# EAGLE design goblin (EAGLE 6.6.0)

## Sheet 1 of 2
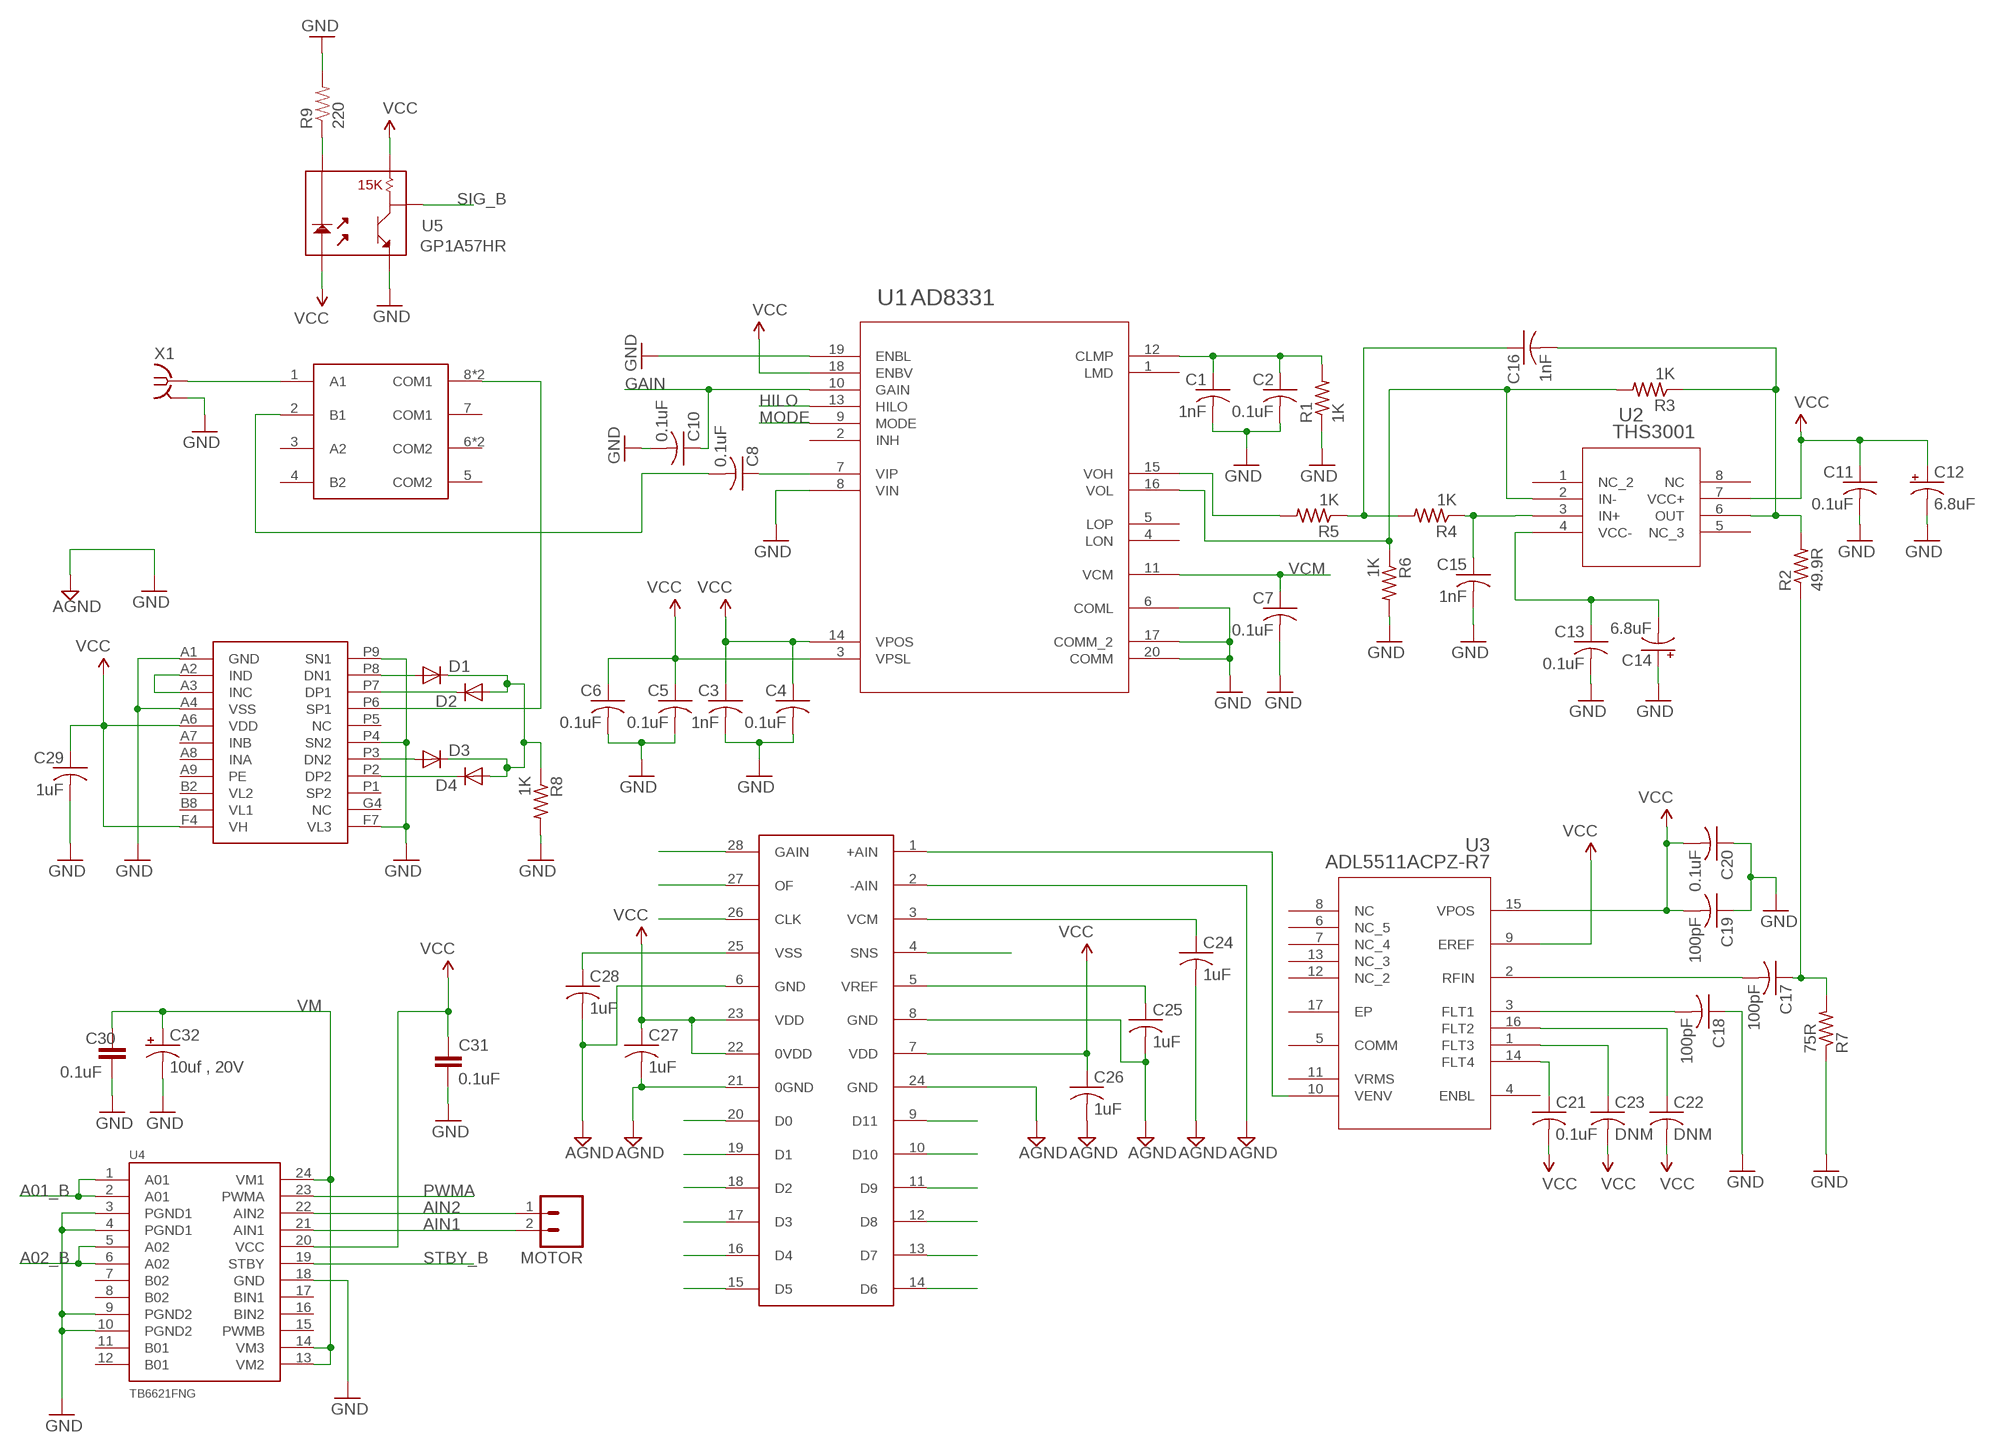
[diagram p0: schematic, sheet 1]

### Parts
C1  1nF  C-USC0402  [C0402]
C2  0.1uF  C-USC0402  [C0402]
C3  1nF  C-USC0402  [C0402]
C4  0.1uF  C-USC0402  [C0402]
C5  0.1uF  C-USC0402  [C0402]
C6  0.1uF  C-USC0402  [C0402]
C7  0.1uF  C-USC0402  [C0402]
C8  0.1uF  C-USC0402  [C0402]
C10  0.1uF  C-USC0402  [C0402]
C11  0.1uF  C-USC0402  [C0402]
C12  6.8uF  CPOL-USA/3216-18W  [A/3216-18W]
C13  0.1uF  C-USC0402  [C0402]
C14  6.8uF  CPOL-USA/3216-18W  [A/3216-18W]
C15  1nF  C-USC0402  [C0402]
C16  1nF  C-USC0402  [C0402]
C17  100pF  C-USC0402  [C0402]
C18  100pF  C-USC0402  [C0402]
C19  100pF  C-USC0402  [C0402]
C20  0.1uF  C-USC0402  [C0402]
C21  0.1uF  C-USC0402  [C0402]
C22  DNM  C-USC0402  [C0402]
C23  DNM  C-USC0402  [C0402]
C24  1uF  C-USC0402  [C0402]
C25  1uF  C-USC0402  [C0402]
C26  1uF  C-USC0402  [C0402]
C27  1uF  C-USC0402  [C0402]
C28  1uF  C-USC0402  [C0402]
C29  1uF  C-USC0402  [C0402]
C30  0.1uF  CAP0402-CAP  [0402-CAP]
C31  0.1uF  CAP0402-CAP  [0402-CAP]
C32  10uf , 20V  CAP_POL3528  [EIA3528]
D1  DIODESOD  [SOD-323]
D2  DIODESOD  [SOD-323]
D3  DIODESOD  [SOD-323]
D4  DIODESOD  [SOD-323]
MOTOR  M02PTH3  [1X02_LONGPADS]
R1  1K  R-US_R0402  [R0402]
R2  49.9R  R-US_R0402  [R0402]
R3  1K  R-US_R0402  [R0402]
R4  1K  R-US_R0402  [R0402]
R5  1K  R-US_R0402  [R0402]
R6  1K  R-US_R0402  [R0402]
R7  75R  R-US_R0402  [R0402]
R8  1K  R-US_R0402  [R0402]
R9  220  RESISTORPTH1  [AXIAL-0.3]
U1  AD8331  AD8331ARQZ-R7  [RQ_20]
U2  THS3001  THS3001_D_8  [D8]
U3  ADL5511ACPZ-R7  [CP_16_22]
U4  TB6621FNG  [SSOP24]
U5  GP1A57HR  [GP1A57HR]
U6  MDO100  [MDO100]
U7  LT3748  LT3768  [LT3768]
U8  LTC1405  [LTC1405]
X1  SMA-142-0701-871/880  [SMA-142-0701-871]

### Nets
A01_B: U4.1(A01) U4.2(A01) ; also sheet 2
A02_B: U4.5(A02) U4.6(A02) ; also sheet 2
AGND: C24.2 C25.2 C26.2 C27.2 C28.2 U8.2(-AIN) U8.6(GND) U8.8(GND) U8.21(0GND) U8.24(GND) ; supply symbol labelled GND ; also sheet 2
AIN1: MOTOR.2 U4.21(AIN1)
AIN2: MOTOR.1 U4.22(AIN2)
CLK: U8.26(CLK) ; also sheet 2
D0: U8.20(D0) ; also sheet 2
D1: U8.19(D1) ; also sheet 2
D2: U8.18(D2) ; also sheet 2
D3: U8.17(D3) ; also sheet 2
D4: U8.16(D4) ; also sheet 2
D5: U8.15(D5) ; also sheet 2
D6: U8.14(D6) ; also sheet 2
D7: U8.13(D7) ; also sheet 2
D8: U8.12(D8) ; also sheet 2
D9: U8.11(D9) ; also sheet 2
D10: U8.10(D10) ; also sheet 2
D11: U8.9(D11) ; also sheet 2
GAIN: C10.1 U1.10(GAIN)
GAIN_ADC_B: U8.28(GAIN) ; also sheet 2
GND: C1.2 C2.2 C3.2 C4.2 C5.2 C6.2 C7.2 C10.2 C11.2 C12.- C13.2 C14.+ C15.2 C18.1 C19.1 C20.1 C29.2 C30.2 C31.2 C32.C(-) R1.1 R6.2 R7.1 R8.2 R9.P$2 U1.6(COML) U1.8(VIN) U1.17(COMM_2) U1.19(ENBL) U1.20(COMM) U4.3(PGND1) U4.4(PGND1) U4.9(PGND2) U4.10(PGND2) U4.18(GND) U5.5 U7.A1(GND) U7.A4(VSS) U7.F7(VL3) U7.P4(SN2) U7.P9(SN1) X1.2@1 X1.2@2 X1.2@3 X1.2@4 ; also sheet 2
HILO: U1.13(HILO)
MODE: U1.9(MODE)
N$1: U6.1(A1) X1.1
N$2: C1.1 C2.1 R1.2 U1.12(CLMP)
N$3: C8.1 U1.7(VIP)
N$4: C13.1 C14.- U2.4(VCC-)
N$6: C8.2 U6.2(B1)
N$7: C16.2 R2.2 R3.1 U2.6(OUT)
N$8: R3.2 R6.1 U1.16(VOL) U2.2(IN-)
N$9: R5.2 U1.15(VOH)
N$10: C17.2 U3.2(RFIN)
N$11: C18.2 U3.3(FLT1)
N$12: C17.1 R2.1 R7.2
N$13: C16.1 R4.2 R5.1
N$14: C15.1 R4.1 U2.3(IN+)
N$15: U6.8(COM1) U6.9(COM1) U7.P6(SP1)
N$16: C21.1 U3.14(FLT4)
N$17: C22.1 U3.16(FLT2)
N$18: C23.1 U3.1(FLT3)
N$19: C24.1 U8.3(VCM)
N$20: C25.1 U8.5(VREF)
N$21: U7.A2(IND) U7.A3(INC)
N$22: D1.2(A) U7.P8(DN1)
N$23: C28.1 U8.25(VSS)
N$25: D2.1(C) U7.P7(DP1)
N$26: U3.10(VENV) U8.1(+AIN)
N$28: D3.2(A) U7.P3(DN2)
N$29: D4.1(C) U7.P2(DP2)
N$30: D1.1(C) D2.2(A) D3.1(C) D4.2(A) R8.1
N$51: R9.P$1 U5.2
OF_B: U8.27(OF) ; also sheet 2
PWMA: U4.23(PWMA) ; also sheet 2
SIG_B: U5.4 ; also sheet 2
SNS_B: U8.4(SNS) ; also sheet 2
STBY_B: U4.19(STBY) ; also sheet 2
VCC: C3.1 C4.1 C5.1 C6.1 C11.1 C12.+ C19.2 C20.2 C21.2 C22.2 C23.2 C26.1 C27.1 C29.1 C31.1 U1.3(VPSL) U1.14(VPOS) U1.18(ENBV) U2.7(VCC+) U3.9(EREF) U3.15(VPOS) U4.20(VCC) U5.1 U5.3 U7.A6(VDD) U7.F4(VH) U8.7(VDD) U8.22(0VDD) U8.23(VDD) ; also sheet 2
VCM: C7.1 U1.11(VCM)
VM: C30.1 C32.A(+) U4.13(VM2) U4.14(VM3) U4.24(VM1)
Unconnected: U1.1(LMD) U1.2(INH) U1.4(LON) U1.5(LOP) U2.1(NC_2) U2.5(NC_3) U2.8(NC) U3.4(ENBL) U3.5(COMM) U3.6(NC_5) U3.7(NC_4) U3.8(NC) U3.11(VRMS) U3.12(NC_2) U3.13(NC_3) U3.17(EP) U4.7(B02) U4.8(B02) U4.11(B01) U4.12(B01) U4.15(PWMB) U4.16(BIN2) U4.17(BIN1) U6.3(A2) U6.4(B2) U6.5(COM2) U6.6(COM2) U6.7(COM1) U6.10(COM2) U7.A7(INB) U7.A8(INA) U7.A9(PE) U7.B2(VL2) U7.B8(VL1) U7.G4(NC) U7.P1(SP2) U7.P5(NC)

### Notes on the sheet
- GAIN
- HILO
- MODE
- VCM

## Sheet 2 of 2
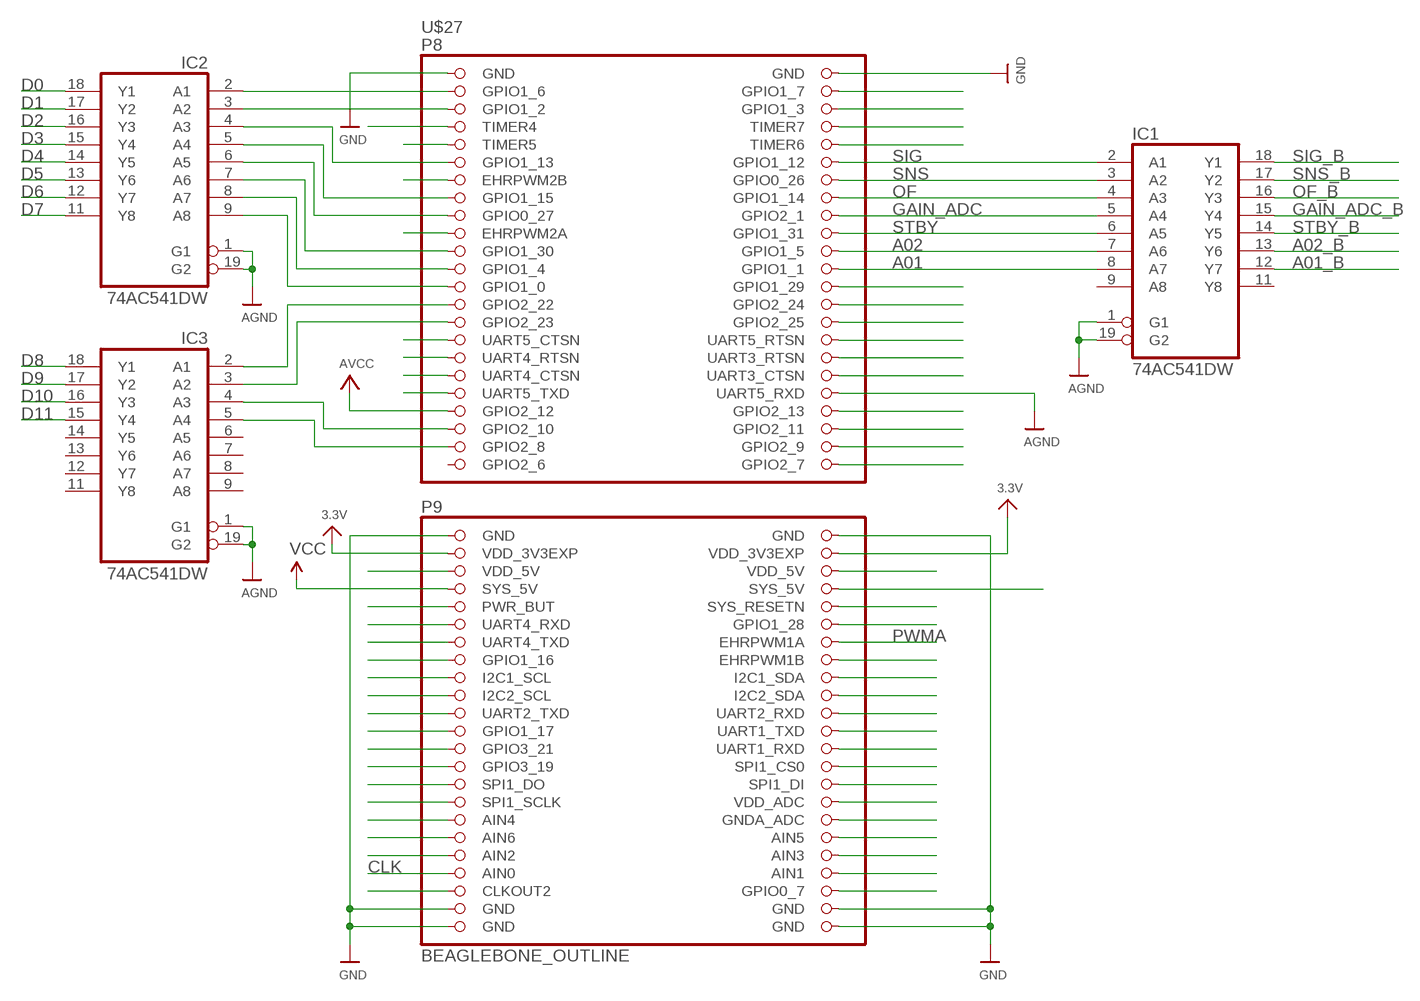
[diagram p1: schematic, sheet 2]

### Parts
IC1  74AC541DW  [SO20W]
IC2  74AC541DW  [SO20W]
IC3  74AC541DW  [SO20W]
U$27  BEAGLEBONE_OUTLINE  [BEAGLEBONE_SHIELD]

### Nets
3.3V: U$27.49(VDD_3V3EXP) U$27.50(VDD_3V3EXP)
5.0V: U$27.54(SYS_5V)
A01_B: IC1.12(Y7) ; also sheet 1
A02: IC1.8(A7) U$27.24(GPIO1_1)
A02_B: IC1.13(Y6) ; also sheet 1
AGND: IC1.1(G1) IC1.19(G2) IC2.1(G1) IC2.19(G2) IC3.1(G1) IC3.19(G2) U$27.38(UART5_RXD) ; also sheet 1
AVCC: U$27.39(GPIO2_12)
CLK: U$27.87(CLKOUT2) ; also sheet 1
D0: IC2.18(Y1) ; also sheet 1
D1: IC2.17(Y2) ; also sheet 1
D2: IC2.16(Y3) ; also sheet 1
D3: IC2.15(Y4) ; also sheet 1
D4: IC2.14(Y5) ; also sheet 1
D5: IC2.13(Y6) ; also sheet 1
D6: IC2.12(Y7) ; also sheet 1
D7: IC2.11(Y8) ; also sheet 1
D8: IC3.18(Y1) ; also sheet 1
D9: IC3.17(Y2) ; also sheet 1
D10: IC3.16(Y3) ; also sheet 1
D11: IC3.15(Y4) ; also sheet 1
GAIN_ADC: IC1.5(A4) U$27.18(GPIO2_1)
GAIN_ADC_B: IC1.15(Y4) ; also sheet 1
GND: U$27.1(GND) U$27.2(GND) U$27.47(GND) U$27.48(GND) U$27.89(GND) U$27.90(GND) U$27.91(GND) U$27.92(GND) ; also sheet 1
N$24: U$27.7(TIMER4)
N$27: U$27.9(TIMER5)
N$31: IC2.5(A4)
N$32: U$27.13(EHRPWM2B)
N$33: IC2.4(A3) U$27.11(GPIO1_13)
N$34: IC2.6(A5) U$27.17(GPIO0_27)
N$35: U$27.19(EHRPWM2A)
N$36: IC2.7(A6) U$27.21(GPIO1_30)
N$37: IC2.8(A7) U$27.23(GPIO1_4)
N$38: IC2.9(A8) U$27.25(GPIO1_0)
N$39: IC3.2(A1) U$27.27(GPIO2_22)
N$40: IC3.3(A2) U$27.29(GPIO2_23)
N$41: U$27.31(UART5_CTSN)
N$42: U$27.33(UART4_RTSN)
N$43: U$27.35(UART4_CTSN)
N$44: U$27.37(UART5_TXD)
N$45: IC3.4(A3) U$27.41(GPIO2_10)
N$46: IC3.5(A4) U$27.43(GPIO2_8)
N$48: U$27.8(TIMER7)
N$49: U$27.10(TIMER6)
N$55: IC1.7(A6) U$27.22(GPIO1_5)
N$57: U$27.26(GPIO1_29)
N$58: U$27.28(GPIO2_24)
N$59: U$27.30(GPIO2_25)
N$60: U$27.32(UART5_RTSN)
N$61: U$27.34(UART3_RTSN)
N$62: U$27.36(UART3_CTSN)
N$63: U$27.40(GPIO2_13)
N$64: U$27.42(GPIO2_11)
N$65: U$27.44(GPIO2_9)
N$66: U$27.46(GPIO2_7)
N$67: U$27.51(VDD_5V)
N$68: U$27.55(PWR_BUT)
N$69: U$27.57(UART4_RXD)
N$70: U$27.59(UART4_TXD)
N$71: U$27.61(GPIO1_16)
N$72: U$27.63(I2C1_SCL)
N$73: U$27.65(I2C2_SCL)
N$74: U$27.67(UART2_TXD)
N$75: U$27.69(GPIO1_17)
N$76: U$27.71(GPIO3_21)
N$77: U$27.73(GPIO3_19)
N$78: U$27.75(SPI1_DO)
N$79: U$27.77(SPI1_SCLK)
N$80: U$27.79(AIN4)
N$81: U$27.81(AIN6)
N$82: U$27.83(AIN2)
N$83: U$27.85(AIN0)
N$85: U$27.52(VDD_5V)
N$86: U$27.56(SYS_RESETN)
N$87: U$27.58(GPIO1_28)
N$89: U$27.62(EHRPWM1B)
N$90: U$27.64(I2C1_SDA)
N$91: U$27.66(I2C2_SDA)
N$92: U$27.68(UART2_RXD)
N$93: U$27.70(UART1_TXD)
N$94: U$27.72(UART1_RXD)
N$95: U$27.74(SPI1_CS0)
N$96: U$27.76(SPI1_DI)
N$97: U$27.78(VDD_ADC)
N$98: U$27.80(GNDA_ADC)
N$99: U$27.82(AIN5)
N$100: U$27.84(AIN3)
N$101: U$27.86(AIN1)
N$102: IC2.2(A1) U$27.3(GPIO1_6)
N$103: IC2.3(A2) U$27.5(GPIO1_2)
N$104: U$27.4(GPIO1_7)
N$105: U$27.6(GPIO1_3)
N$106: U$27.88(GPIO0_7)
OF: IC1.4(A3) U$27.16(GPIO1_14)
OF_B: IC1.16(Y3) ; also sheet 1
PWMA: U$27.60(EHRPWM1A) ; also sheet 1
SIG: IC1.2(A1) U$27.12(GPIO1_12)
SIG_B: IC1.18(Y1) ; also sheet 1
SNS: IC1.3(A2) U$27.14(GPIO0_26)
SNS_B: IC1.17(Y2) ; also sheet 1
STBY: IC1.6(A5) U$27.20(GPIO1_31)
STBY_B: IC1.14(Y5) ; also sheet 1
VCC: U$27.53(SYS_5V) ; also sheet 1
Unconnected: IC1.9(A8) IC1.11(Y8) IC3.6(A5) IC3.7(A6) IC3.8(A7) IC3.9(A8) IC3.11(Y8) IC3.12(Y7) IC3.13(Y6) IC3.14(Y5) U$27.15(GPIO1_15)

### Notes on the sheet
- D0
- D1
- D2
- D3
- D4 | SIG | SIG_B
- D5 | SNS | SNS_B
- D6 | OF | OF_B
- D7 | GAIN_ADC | GAIN_ADC_B
- STBY | STBY_B
- A02 | A02_B
- A01 | A01_B
- D8
- D9
- D10
- D11
- PWMA
- CLK

## Power pins joined to a net without a drawn wire
GND: IC1.10(GND) IC2.10(GND) IC3.10(GND)
GPIO2_6: U$27.45(GPIO2_6)
VCC: IC1.20(VCC) IC2.20(VCC) IC3.20(VCC)

## Library data of the parts
C1-C8 C10 C11 C13 C15-C29 = adafruit:C-US: CAPACITOR, American symbol; OC_FARNELL: unknown
C12 C14 = adafruit:CPOL-US: POLARIZED CAPACITOR, American symbol; OC_FARNELL: unknown
C30 C31 = SparkFun:CAP: Capacitor Standard 0603 ceramic capacitor, and 0.1" leaded capacitor.; OC_FARNELL: unknown
C32 = SparkFun:CAP_POL: Capacitor Polarized These are standard SMD and PTH capacitors. Normally 10uF, 47uF, and 100uF in electrolytic and tantalum varieties. Always verify the external diameter of the through hole cap, it varies with capacity, voltage, and manufacturer. The EIA devices should be standard.; OC_FARNELL: unknown
D1-D4 = SparkFun-DiscreteSemi:DIODE: Diode These are standard reverse protection diodes and small signal diodes. SMA package can handle up to about 1A. SOD-323 can handle about 200mA. What the SOD-323 package when ordering, there are some mfgs out there that are 5-pin packages.; OC_FARNELL: unknown; PROD_ID: DIO-09646
IC1-IC3 = 74xx-eu:74*541: Octal BUFFER and LINE DRIVER, 3-state
MOTOR = SparkFun-Connectors:M02: Standard 2-pin 0.1" header. Use with - straight break away headers ( PRT-00116) - right angle break away headers (PRT-00553) - swiss pins (PRT-00743) - machine pins (PRT-00117) - female headers (PRT-00115) Molex polarized connector foot print use with: PRT-08233 with associated crimp pins and housings. 2.54_SCREWTERM for use with PRT-10571. 3.5mm Screw Terminal footprints for PRT-08084 5mm Screw Terminal footprints for use with PRT-08433; OC_FARNELL: unknown
R1-R8 = adafruit:R-US_: RESISTOR, American symbol; OC_FARNELL: unknown
R9 = SparkFun:RESISTOR: Resistor Basic schematic elements and footprints for 0603, 1206, and PTH 1/10th watt (small) resistors.; OC_FARNELL: unknown
U1 = AD8331ARQZ-R7:AD8331ARQZ-R7; MANUFACTURER_PART_NUMBER: AD8331ARQZ-R7; OC_FARNELL: unknown; VENDOR: Vendor
U2 = THS3001:THS3001_D_8; DATASHEETURL: http://www.ti.com/lit/gpn/THS3001; DESCRIPTION: 420-MHz Current-Feedback Amplifier; FAMILY_NAME: CURRENT FEEDBACK; GENERIC_PART_NUMBER: THS3001; INDUSTRY_STD_PKG_TYPE: SOIC; MANUFACTURER: Texas Instruments; MANUFACTURER_PART_NUMBER: ths3001_d_8; OC_FARNELL: unknown; PACKAGE_DESIGNATOR: D; PIN_COUNT: 8; VENDOR: Texas Instruments
U3 = ADL5511:ADL5511ACPZ-R7; OC_FARNELL: unknown
U4 = SparkFun:TB6621FNG: Toshiba 1A motor driver; OC_FARNELL: unknown
U5 = SparkFun:GP1A57HR; OC_FARNELL: unknown
U6 = MDO100:MDO100; OC_FARNELL: unknown
U7 = HV7360:LT3768; OC_FARNELL: unknown
U8 = LTC1405:LTC1405; OC_FARNELL: unknown
U$27 = microbuilder:BEAGLEBONE_OUTLINE; OC_FARNELL: unknown
X1 = con-coax:SMA-: SMA 50 Ohm End Launch Jack Receptacle - Round Contact Johnson Components Source: www.johnsoncomponents.com .. J502-ND.pdf; OC_FARNELL: unknown; OC_NEWARK: 91B6105

## Board
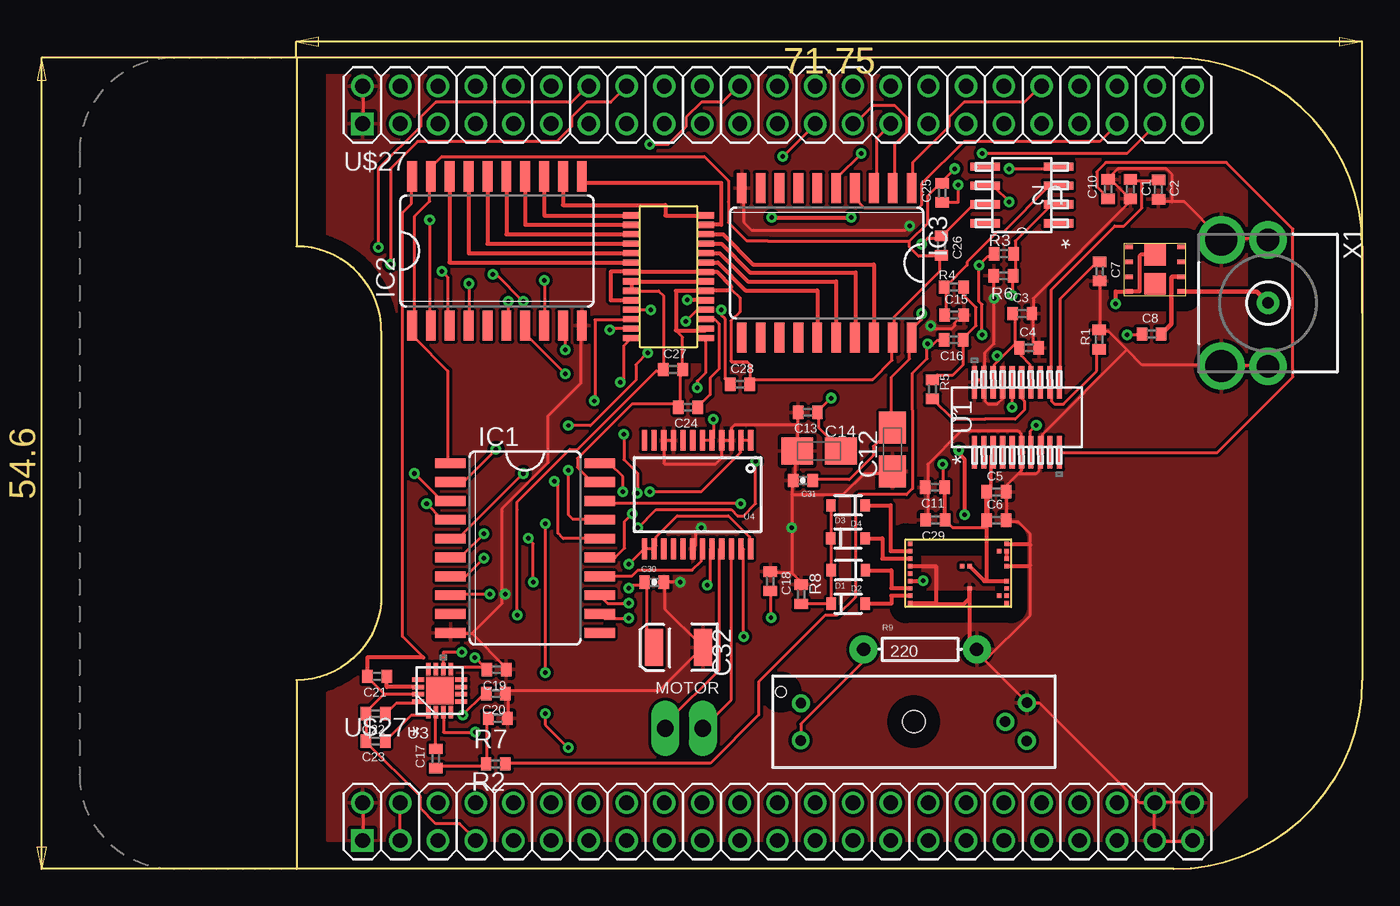
[diagram p2: board, top side]
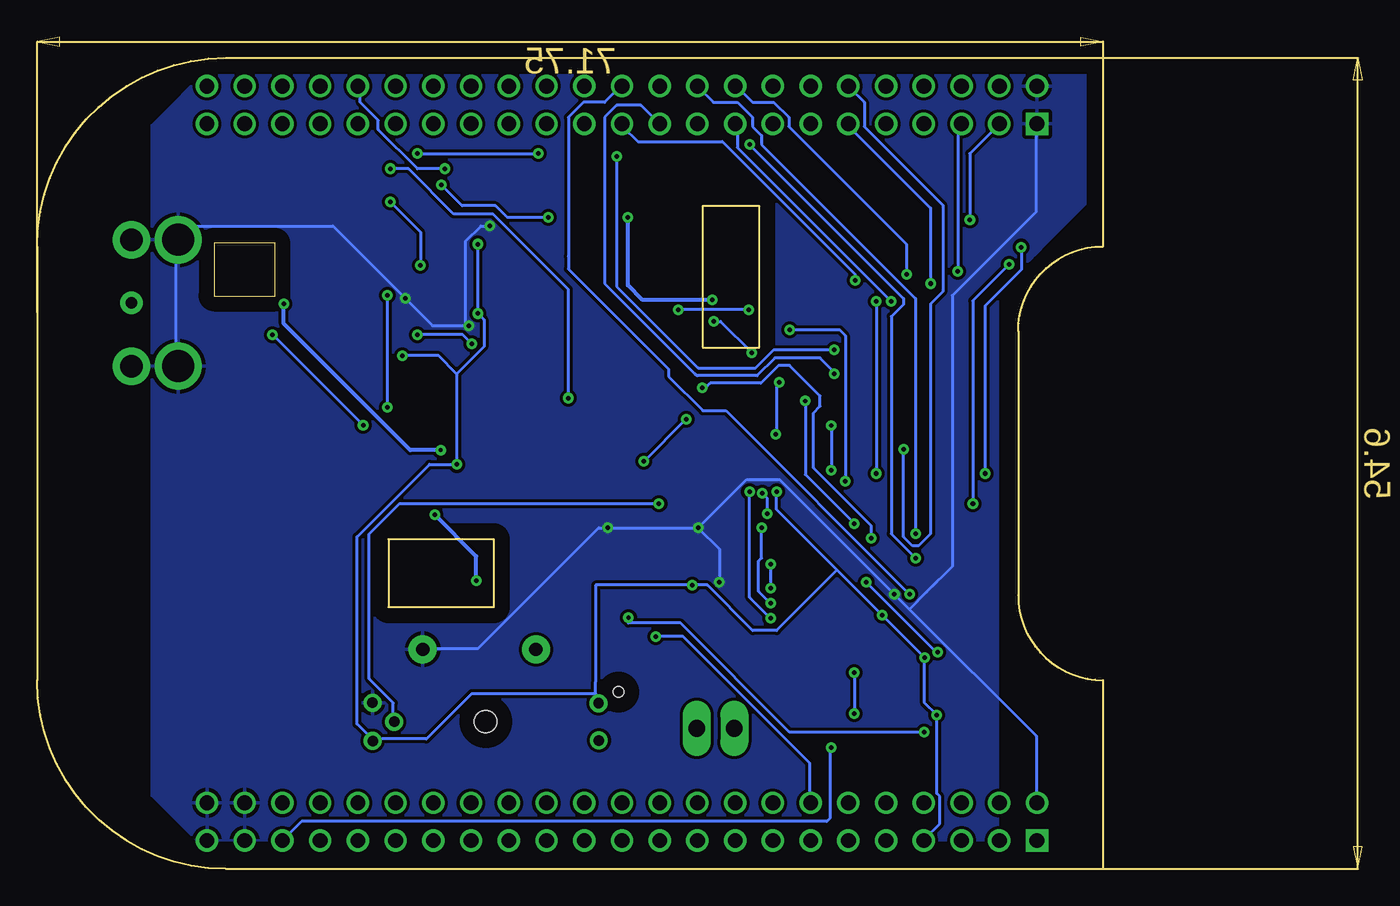
[diagram p3: board, bottom side, seen from below]

Size 71.75 x 54.61 mm. Coordinates in mm from the lower left corner, seen from the top.
Copper layers (1*16): Top 0.035mm / dielectric 1.5mm / Bottom 0.035mm
Design rules "default *": minimum track width 8mil, minimum drill 12mil, track to track 8mil, track to pad 8mil, pad to pad 8mil, via to via 8mil, smd to smd 8mil, copper to edge 40mil, drill to drill 8mil, minimum pad ring 10mil, minimum via ring 8mil, stop-mask expansion 4mil, vias tented up to drill 0mil, thermal gap 10mil

### Footprints (pad centres in the part's own frame; a part is rotated, then mirrored left to right if it is on the bottom)
C0402 = smd 0.7 x 0.9: 1 -0.65,0; 2 0.65,0
A/3216-18W = smd 2.15 x 1.8: + 1.475,0; - -1.475,0
0402-CAP = smd 0.7 x 0.9: 1 -0.65,0; 2 0.65,0
EIA3528 = smd 1.2 x 2.5: A 1.65,0; C -1.65,0
SOD-323 = smd 0.63 x 0.83: 1 -1.15,0; 2 1.15,0
SO20W = smd 0.66 x 2.032: 1 -5.715,-5.029; 2 -4.445,-5.029; 3 -3.175,-5.029; 4 -1.905,-5.029; 5 -0.635,-5.029; 6 0.635,-5.029; 7 1.905,-5.029; 8 3.175,-5.029; 9 4.445,-5.029; 10 5.715,-5.029; 11 5.715,5.029; 12 4.445,5.029; 13 3.175,5.029; 14 1.905,5.029; 15 0.635,5.029; 16 -0.635,5.029; 17 -1.905,5.029; 18 -3.175,5.029; 19 -4.445,5.029; 20 -5.715,5.029
1X02_LONGPADS = drill 1.118 pad 1.88 long: 1 0,0; 2 2.54,0
R0402 = smd 0.7 x 0.9: 1 -0.65,0; 2 0.65,0
AXIAL-0.3 = drill 0.9 pad 1.88: P$1 -3.81,0; P$2 3.81,0
RQ_20 = smd 2.184 x 0.356: 1 -2.362,2.857; 2 -2.362,2.223; 3 -2.362,1.587; 4 -2.362,0.953; 5 -2.362,0.318; 6 -2.362,-0.318; 7 -2.362,-0.953; 8 -2.362,-1.587; 9 -2.362,-2.223; 10 -2.362,-2.857; 11 2.362,-2.857; 12 2.362,-2.223; 13 2.362,-1.587; 14 2.362,-0.953; 15 2.362,-0.318; 16 2.362,0.318; 17 2.362,0.953; 18 2.362,1.587; 19 2.362,2.223; 20 2.362,2.857
D8 = smd 1.981 x 0.559: 1 -2.464,1.905; 2 -2.464,0.635; 3 -2.464,-0.635; 4 -2.464,-1.905; 5 2.464,-1.905; 6 2.464,-0.635; 7 2.464,0.635; 8 2.464,1.905
CP_16_22 = smd 0.813 x 0.305: 1 -1.448,0.75; 2 -1.448,0.25; 3 -1.448,-0.25; 4 -1.448,-0.75; 9 1.448,-0.75; 10 1.448,-0.25; 11 1.448,0.25; 12 1.448,0.75 | smd 0.305 x 0.813: 5 -0.75,-1.448; 6 -0.25,-1.448; 7 0.25,-1.448; 8 0.75,-1.448; 13 0.75,1.448; 14 0.25,1.448; 15 -0.25,1.448; 16 -0.75,1.448 | smd 1.854 x 1.854: 17 0,0
SSOP24 = smd 0.348 x 1.397: 1 -3.575,-3.656; 2 -2.925,-3.656; 3 -2.275,-3.656; 4 -1.625,-3.656; 5 -0.975,-3.656; 6 -0.325,-3.656; 7 0.325,-3.656; 8 0.975,-3.656; 9 1.625,-3.656; 10 2.275,-3.656; 11 2.925,-3.656; 12 3.575,-3.656; 13 3.575,3.656; 14 2.925,3.656; 15 2.275,3.656; 16 1.625,3.656; 17 0.975,3.656; 18 0.325,3.656; 19 -0.325,3.656; 20 -0.975,3.656; 21 -1.625,3.656; 22 -2.275,3.656; 23 -2.925,3.656; 24 -3.575,3.656
GP1A57HR = drill 0.7: 1 -7.6,1.24; 2 -7.62,-1.27; 3 7.6,-1.3; 4 6.15,0; 5 7.62,1.27 | hole 1.5: 0,0 | hole 0.7: -8.95,2
MDO100 = smd 0.3 x 0.5: 1 -1.5,-1.75; 2 -0.5,-1.75; 3 0.5,-1.75; 4 1.5,-1.75; 5 1.5,1.75; 6 0.5,1.75; 7 -0.5,1.75; 8 -1.5,1.75 | smd 1.45 x 1.45: 9 0.975,0; 10 -0.975,0
LT3768 = smd 0.3 x 0.3: A1 -3.25,-2; A2 -3.25,-1.5; A3 -3.25,-1; A4 -3.25,-0.5; A6 -3.25,0.5; A7 -3.25,1; A8 -3.25,1.5; A9 -3.25,2; B2 -2.75,-1.5; B8 -2.75,1.5; F4 -0.75,-0.5; F7 -0.75,1; G4 -0.25,-0.5; P1 3.25,-2; P2 3.25,-1.5; P3 3.25,-1; P4 3.25,-0.5; P5 3.25,0; P6 3.25,0.5; P7 3.25,1; P8 3.25,1.5; P9 3.25,2
LTC1405 = smd 1.143 x 0.419: 1 -2.477,4.128; 2 -2.477,3.493; 3 -2.477,2.857; 4 -2.477,2.223; 5 -2.477,1.587; 6 -2.477,0.953; 7 -2.477,0.318; 8 -2.477,-0.318; 9 -2.477,-0.953; 10 -2.477,-1.587; 11 -2.477,-2.223; 12 -2.477,-2.857; 13 -2.477,-3.493; 14 -2.477,-4.128; 15 2.477,-4.128; 16 2.477,-3.493; 17 2.477,-2.857; 18 2.477,-2.223; 19 2.477,-1.587; 20 2.477,-0.953; 21 2.477,-0.318; 22 2.477,0.318; 23 2.477,0.953; 24 2.477,1.587; 25 2.477,2.223; 26 2.477,2.857; 27 2.477,3.493; 28 2.477,4.128
BEAGLEBONE_SHIELD = drill 1 square: 1 4.445,19.05; 47 52.705,19.05 | drill 1: 2 1.905,19.05; 3 4.445,21.59; 4 1.905,21.59; 5 4.445,24.13; 6 1.905,24.13; 7 4.445,26.67; 8 1.905,26.67; 9 4.445,29.21; 10 1.905,29.21; 11 4.445,31.75; 12 1.905,31.75; 13 4.445,34.29; 14 1.905,34.29; 15 4.445,36.83; 16 1.905,36.83; 17 4.445,39.37; 18 1.905,39.37; 19 4.445,41.91; 20 1.905,41.91; 21 4.445,44.45; 22 1.905,44.45; 23 4.445,46.99; 24 1.905,46.99; 25 4.445,49.53; 26 1.905,49.53; 27 4.445,52.07; 28 1.905,52.07; 29 4.445,54.61; 30 1.905,54.61; 31 4.445,57.15; 32 1.905,57.15; 33 4.445,59.69; 34 1.905,59.69; 35 4.445,62.23; 36 1.905,62.23; 37 4.445,64.77; 38 1.905,64.77; 39 4.445,67.31; 40 1.905,67.31; 41 4.445,69.85; 42 1.905,69.85; 43 4.445,72.39; 44 1.905,72.39; 45 4.445,74.93; 46 1.905,74.93; 48 50.165,19.05; 49 52.705,21.59; 50 50.165,21.59; 51 52.705,24.13; 52 50.165,24.13; 53 52.705,26.67; 54 50.165,26.67; 55 52.705,29.21; 56 50.165,29.21; 57 52.705,31.75; 58 50.165,31.75; 59 52.705,34.29; 60 50.165,34.29; 61 52.705,36.83; 62 50.165,36.83; 63 52.705,39.37; 64 50.165,39.37; 65 52.705,41.91; 66 50.165,41.91; 67 52.705,44.45; 68 50.165,44.45; 69 52.705,46.99; 70 50.165,46.99; 71 52.705,49.53; 72 50.165,49.53; 73 52.705,52.07; 74 50.165,52.07; 75 52.705,54.61; 76 50.165,54.61; 77 52.705,57.15; 78 50.165,57.15; 79 52.705,59.69; 80 50.165,59.69; 81 52.705,62.23; 82 50.165,62.23; 83 52.705,64.77; 84 50.165,64.77; 85 52.705,67.31; 86 50.165,67.31; 87 52.705,69.85; 88 50.165,69.85; 89 52.705,72.39; 90 50.165,72.39; 91 52.705,74.93; 92 50.165,74.93
SMA-142-0701-871 = drill 0.762 pad 1.524: 1 0,0 | drill 1.524 pad 2.54: 2@1 -4.255,0; 2@2 4.255,0 | drill 2.159 pad 2.794: 2@3 -4.255,-3.15; 2@4 4.255,-3.15

### Placement (x,y rotation side)
C1  56.13,45.76 270 top
C2  58.02,45.73 270 top
C3  48.86,37.39 0 top
C4  49.31,35.08 0 top
C5  47.11,25.38 0 top
C6  47.11,23.48 0 top
C7  54.08,40.23 270 top
C8  57.56,36.01 0 top
C10  54.63,45.77 90 top
C11  42.97,25.69 180 top
C12  40.11,28.24 90 top
C13  34.42,30.74 180 top
C14  35.19,28.13 180 top
C15  44.28,37.29 0 top
C16  44.25,35.61 180 top
C17  9.39,7.43 90 top
C18  31.89,19.36 270 top
C19  13.47,13.42 180 top
C20  13.43,11.79 180 top
C21  5.43,12.96 180 top
C22  5.32,10.46 180 top
C23  5.32,8.61 180 top
C24  26.36,31.08 180 top
C25  43.47,45.51 90 top
C26  43.42,41.97 270 top
C27  25.35,33.62 0 top
C28  29.86,32.62 0 top
C29  43.02,23.49 180 top
C30  24.08,19.29 0 top
C31  34.09,26.15 180 top
C32  25.72,14.9 180 top
D1  37.14,17.85 0 top
D2  37.16,20.1 180 top
D3  37.12,22.25 0 top
D4  37.14,24.47 180 top
IC1  15.39,21.6 270 top
IC2  13.5,41.6 0 top
IC3  35.69,40.8 180 top
MOTOR  27.36,9.46 180 top
R1  54.05,35.64 270 top
R2  13.41,7.07 0 top
R3  47.62,41.42 0 top
R4  44.27,39.17 0 top
R5  42.81,32.29 270 top
R6  47.59,39.93 180 top
R7  13.55,10.13 180 top
R8  33.97,18.49 90 top
R9  41.98,14.78 0 top
U1  48.5,30.4 90 top
U2  48.83,45.37 180 top
U3  9.64,12 90 top
U4  27,25.2 180 top
U5  41.56,9.91 0 top
U6  57.8,40.37 90 top
U7  44.55,19.88 180 top
U8  25.04,39.87 180 top
U$27  -14.61,54.61 270 top
X1  65.41,38.1 270 top

### Tracks (layer width: path | path; a pad name or v marks a point on that pad's centre or on a via)
3.3V
  Top 0.203: U$27.49 6.93,2.03 6.93,4.27 U$27.50
A01_B  (via drill 0.3)
  Top 0.203: U4.1 30.5,28.85 30.1,28.85 U4.2 29.9,28.85 29.9,28.04 27.25,25.4 v23.8,25.4 | v22.38,16.87 20.75,16.87 20.55,17.07 IC1.12
  Bottom 0.203: v23.8,25.4 23.8,18.29 v22.38,16.87
A02  (via drill 0.3)
  Top 0.203: v13.03,18.49 10.39,18.49 IC1.8
  Bottom 0.2: 35.99,41.25 35.99,40.4 29.25,33.65 29.25,33.15 26.94,30.85 25.39,30.85 v13.03,18.49
  Bottom 0.203: 35.99,41.25 35.99,50.6 34.98,51.61 33.55,51.61 32.54,52.63 U$27.24
A02_B  (via drill 0.3)
  Top 0.203: U4.6 27.46,28.85 27.86,28.85 U4.5 28.07,29.06 v28.07,30.28 | v30.91,27.43 30.91,24.59 30.1,23.77 29.69,23.77 29.29,24.18 24.21,24.18 v22.99,22.96 | v22.38,17.88 20.96,17.88 20.55,18.29 IC1.13
  Bottom 0.203: v30.91,27.43 v28.07,30.28 | v22.99,22.96 22.99,20.93 23.19,20.73 23.19,18.69 v22.38,17.88
AGND  (via drill 0.3)
  Top 0.2: 29.08,44.91 29.08,43.51 30.33,42.27 31.72,42.27 | 29.29,34.14 30.36,34.14 | 30.36,34.14 30.54,33.95 30.54,32.95 | 30.54,32.95 30.54,32.65 C28.2 | C27.2 26,35.8 25.54,36.25 | 28.29,40.2 28.29,40.15 29.25,39.2 | 30.36,34.14 30.35,34.15 29.29,34.15 29.25,34.2 29.25,36.9 29.85,37.5 29.85,38.45 29.29,39.01 | 30.54,32.95 38.8,32.95 40.09,34.25 40.09,35.73 IC3.19
  Top 0.203: IC1.1 10.18,27.43 10.18,33.53 7.95,35.76 7.95,36.37 IC2.1 7.95,36.58 7.95,43.94 8.97,44.95 8.97,46.53 IC2.19 9.17,46.74 9.17,47.35 9.78,47.95 27.46,47.95 29.08,46.33 29.08,44.91 | IC3.1 41.48,45.92 41.48,47.55 43.92,49.99 43.92,50.6 44.93,51.61 49,51.61 50.01,52.63 U$27.38 | 43.31,41.25 43.31,40.23 40.26,37.19 40.26,35.97 IC3.19 | 41.28,42.27 42.49,43.48 42.49,45.31 43.31,46.13 C25.2 43.51,46.33 v44.32,47.14 | 41.28,42.27 41.28,41.86 41.89,41.25 43.31,41.25 | 43.31,41.25 C26.2 | C27.2 25.83,33.53 25.83,31.5 C24.2 25.63,31.29 22.58,31.29 18.92,27.64 18.92,27.03 19.74,26.21 20.35,26.21 IC1.19 | 29.29,39.01 29.25,39.1 | 31.72,42.27 41.28,42.27
  Top 0.254: U8.24 21.14,38.28 21.14,40.2 U8.21 U8.8 28.29,40.2 29.25,39.25 29.25,39.2 29.25,39.1 29.1,38.95 27.55,38.95 U8.6 25.54,38.92 25.54,36.25 27.52,36.25 U8.2
  Bottom 0.203: v44.32,47.14 46.15,47.14 48.79,49.78 48.79,50.39 50.01,51.61 50.01,52.63 U$27.38
AIN1
  Top 0.203: U4.21 28.47,21.54 28.47,13.41 25.02,9.96 25.02,9.55 MOTOR.2
AIN2
  Top 0.203: U4.22 29.29,11.38 27.46,9.55 MOTOR.1
CLK  (via drill 0.3)
  Top 0.2: U8.26 22.57,36.95 20.1,36.95 20.1,31.55 v20.04,31.5 | v16.75,23.25 v16.75,13.2 | v16.75,10.45 16.75,9.7 v18.29,8.15
  Bottom 0.2: v20.04,31.5 20.04,26.55 v16.75,23.25 | v16.75,13.2 v16.75,10.45 | v18.29,8.15 18.39,8.05 18.39,3.4 18.6,3.2 53.95,3.2 U$27.87
D0
  Top 0.254: IC2.18 10.29,46.63 10.29,40.82 U8.20
D1
  Top 0.254: IC2.17 11.59,41.46 U8.19
D2
  Top 0.254: IC2.16 12.86,42.09 U8.18
D3
  Top 0.254: IC2.15 14.13,42.73 U8.17
D4
  Top 0.254: IC2.14 15.4,43.36 U8.16
D5
  Top 0.254: IC2.13 16.67,44 U8.15
D6
  Top 0.254: IC2.12 17.94,44.7 24.85,44.7 24.85,44 U8.14
D7
  Top 0.254: IC2.11 19.21,46.2 28.6,46.2 28.6,43.36 U8.13
D8
  Top 0.254: U8.12 28.72,42.73 30.75,40.7 38.87,40.7 IC3.18
D9
  Top 0.254: U8.11 28.6,42.09 30.54,40.15 37.64,40.15 37.64,35.82 IC3.17
D10
  Top 0.254: U8.10 28.49,41.46 30.39,39.55 36.33,39.55 IC3.16
D11
  Top 0.254: U8.9 28.37,40.82 30.25,38.95 35.06,38.95 IC3.15
GAIN
  Top 0.203: C10.1 54.48,45.31 53.87,45.92 53.87,46.94 54.48,47.55 62.61,47.55 67.08,43.08 67.08,33.12 62,28.04 51.44,28.04 U1.10
GAIN_ADC  (via drill 0.3)
  Top 0.203: v15.27,26.62 11,22.35 10.39,22.35 IC1.5 | v15.27,38.2 13.44,40.03 v13.23,40.03
  Bottom 0.203: v15.27,38.2 v15.27,26.62 | v13.23,40.03 13.23,42.06 21.16,49.99 21.16,50.6 22.17,51.61 23.6,51.61 24.61,52.63 U$27.18
GAIN_ADC_B  (via drill 0.3)
  Top 0.2: IC1.15 21.46,20.96 22.1,21.6 22.1,23.4 v22.6,23.9 | v21.79,32.75 22.04,33 22.04,35.22 U8.28 | v22.04,29.25 22.04,27.55 22.94,26.65 v22.94,25.3
  Bottom 0.2: v22.6,23.9 22.6,24.95 v22.94,25.3 | v21.79,32.75 22,32.75 22,29.3 v22.04,29.25
GND  (via drill 0.3)
  Top 0.2: 30.1,45.11 30.1,43.55 30.64,43 40.99,43 v41.28,43.28 | U4.10 24.73,27.32 24.79,27.25 28.19,27.25 28.64,27.7 28.64,28.84 U4.4 | 13.84,24.07 13.84,24.25 16.95,27.35 16.95,30.5 19.14,32.7 19.14,35.85 19.25,35.95 19.25,36.54 IC2.10
  Top 0.203: C29.2 42.49,23.57 42.49,25.6 C11.2 42.49,25.81 42.49,27.23 44.73,29.46 48.59,29.46 48.79,29.26 48.79,28.04 U1.6 48.79,27.84 48.79,26.82 48.59,26.62 | 48.59,26.62 47.78,25.81 47.78,25.4 C5.2 47.78,25.2 47.78,23.57 C6.2 47.78,23.37 48.59,23.37 49.4,22.55 49.4,21.8 49.4,20.45 49.4,17.07 46.36,14.02 | 48.59,26.62 49.81,26.62 50.01,26.82 50.01,27.84 U1.8 50.22,28.04 50.22,29.26 55.91,34.95 | C7.2 54.08,39.42 54.08,36.37 R1.1 54.08,36.17 54.69,36.17 55.91,34.95 | 55.91,34.95 56.92,33.93 62.2,33.93 X1.2@4 62.41,33.93 65.25,33.93 X1.2@2 | C4.2 49.81,35.15 49.61,35.36 49.61,37.39 C3.2 49.61,37.59 49.61,38.41 56.11,44.91 C1.2 56.11,45.11 54.69,46.53 | R6.2 46.97,39.83 v46.97,38.41 46.97,35.36 46.36,34.75 46.36,32.92 U1.19 | U1.20 45.75,32.92 46.15,32.92 U1.19 | U1.17 47.57,32.72 47.57,31.7 47.17,31.29 46.56,31.29 46.36,31.5 46.36,32.72 U1.19 | v42.7,36.58 42.9,36.37 44.12,36.37 44.32,36.58 44.32,36.78 44.73,37.19 C15.2 | 58.95,44.91 59.77,44.91 62.2,42.47 X1.2@3 62.41,42.47 65.25,42.47 X1.2@1 | 58.95,44.91 58.14,44.91 C2.2 | 30.1,45.11 30.1,45.72 IC3.10 | 54.69,46.53 55.3,47.14 58.55,47.14 58.95,46.74 58.95,44.91 | 54.69,46.53 C10.2 | 11.81,15.85 14.05,13.61 C19.1 | 11.81,15.85 10.39,15.85 IC1.10 | 13.84,18.49 13.84,17.88 11.81,15.85 | 13.84,18.49 13.84,24.07 | 19.13,36.37 IC2.10 | U4.10 24.82,28.85 25.22,28.85 U4.9 | U4.4 28.68,28.85 U4.3 29.29,29.06 29.29,29.67 29.49,29.87 33.76,29.87 | 33.35,19.91 31.93,19.91 C18.1 | 33.35,19.91 33.96,19.3 R8.2 | 33.76,29.87 33.76,28.25 C14.+ 33.55,28.04 33.55,26.21 C31.2 33.35,26.01 33.35,25.2 | 33.76,29.87 33.76,30.68 C13.2
  Top 0.203: 33.35,25.2 v33.35,22.96 33.35,19.91 | 33.35,25.2 36.8,25.2 38.23,26.62 40.06,26.62 C12.- | R7.1 14.25,10.16 14.25,11.79 C20.1 14.25,11.99 24.41,11.99 27.25,14.83 C32.C 27.25,15.04 24.82,17.48 24.82,19.1 C30.2 24.82,19.3 v25.83,19.3 | U$27.91 60.17,1.83 57.94,1.83 U$27.89 57.73,2.03 57.73,4.27 U$27.90 | U$27.90 57.94,4.47 60.17,4.47 U$27.92 | U$27.47 4.5,2.03 4.5,4.27 U$27.48 | v27.25,22.96 26.85,22.55 26.85,21.74 U4.18 | 46.36,14.02 45.75,14.63 R9.P$2 46.36,14.02 | 46.36,14.02 49,11.38 U5.5 49.2,11.18 50.01,11.18 56.72,4.47 57.73,4.47 U$27.90 | v14.05,18.49 13.84,18.49 | U$27.1 4.5,50.19 4.5,52.63 U$27.2
  Top 0.254: U7.P4 43.05,20.38 43.05,17.9 43.03,17.88 U7.P9 41.33,17.85 44.94,17.85 45.3,18.21 U7.F7 45.3,14.78 R9.P$2 | U7.A1 49.32,21.88 49.4,21.8 | U7.A4 49.33,20.38 49.4,20.45
  Bottom 0.2: 4.5,44.24 4.65,44.09 10.14,38.6 10.14,20.36 11.88,18.63
  Bottom 0.203: 42.9,36.58 45.14,36.58 v46.97,38.41 51.84,43.28 61.39,43.28 62.2,42.47 X1.2@3 62.41,42.27 62.41,33.93 X1.2@4 | v41.28,43.28 41.89,43.28 42.9,42.27 42.9,36.58 | 42.9,36.58 v42.7,36.58 | v27.25,22.96 v33.35,22.96 33.96,22.96 42.09,14.83 45.75,14.83 R9.P$2 | 13.03,17.48 v14.05,18.49 21.77,26.21 24,26.21 v27.25,22.96 | 13.03,17.48 4.5,8.94 4.5,4.47 U$27.48 | v25.83,19.3 25.83,21.54 v27.25,22.96 | 4.5,44.24 4.5,49.99 U$27.1 | 13.03,17.48 11.88,18.63 11.2,19.3
  pour Top: 2.09,54.05 59.94,54.05 63.94,50.05 63.94,4.85 60.99,1.9 2.09,1.9
  pour Bottom: 1.39,54.1 59.99,54.1 64.05,50.05 64.05,4.95 61.05,1.95 7.14,1.95 7.09,1.9 7.09,38.85 1.2,44.75 1.2,54.1
N$1
  Top 0.305: U6.1 64.63,38.87 X1.1
N$2
  Top 0.203: 56.92,46.33 56.31,46.33 C1.1 | 56.92,46.33 57.94,46.33 C2.1 | R1.2 53.87,34.95 53.87,33.53 51.64,31.29 51.03,31.29 50.83,31.5 50.83,32.72 U1.12 50.83,32.92 50.83,39.01 55.09,43.28 55.7,43.28 56.92,44.5 56.92,46.33
N$3  (via drill 0.3)
  Top 0.203: v55.91,35.97 56.72,35.97 C8.1 | v49.81,29.87 49.4,29.46 49.4,28.04 U1.7
  Bottom 0.203: v49.81,29.87 v55.91,35.97
N$4  (via drill 0.3)
  Top 0.203: C14.- 36.6,28.25 35.18,29.67 35.18,30.68 C13.1 35.18,30.89 v35.99,31.7 | v47.98,47.14 51.23,47.14 U2.4
  Bottom 0.203: v47.98,47.14 46.76,47.14 43.71,44.09 41.07,44.09 35.99,39.01 v35.99,31.7
N$6
  Top 0.305: U6.2 58.96,39.87 58.89,39.8 58.89,36.69 C8.2
N$7  (via drill 0.3)
  Top 0.2: 41.48,30.89 41.48,33.38 42.44,34.35 42.44,35.31 v42.49,35.36
  Top 0.203: v47.98,44.91 46.97,45.92 46.56,45.92 U2.6 | R3.1 46.97,41.25 46.56,41.25 v45.95,40.64 45.95,38.2 46.15,38 v46.15,35.97 | 41.48,30.89 41.48,25.6 41.07,25.2 37.82,25.2 37.62,24.99 37.62,18.29 36.4,17.07 35.58,17.07 31.11,12.6 31.11,10.36 27.86,7.11 14.25,7.11 R2.2 | C16.2 43.51,35.56 43.1,35.56 42.7,35.15 v42.49,35.36
  Bottom 0.203: v45.95,40.64 45.95,42.88 v47.98,44.91 | v46.15,35.97 43.1,35.97 v42.49,35.36
N$8  (via drill 0.3)
  Top 0.203: U2.2 51.23,44.7 50.83,44.7 48.39,42.27 48.39,41.45 R3.2 48.39,41.25 48.39,40.03 R6.1 48.18,39.83 v48.18,38.61 | v48.18,31.09 48.18,32.72 U1.16
  Bottom 0.203: v48.18,38.61 v48.18,31.09
N$9
  Top 0.2: R5.2 44.18,30.28 46.36,30.28
  Top 0.203: 46.36,30.28 48.39,30.28 49,30.89 49,31.5 48.79,31.7 48.79,32.72 U1.15
N$10
  Top 0.203: U3.2 9.37,10.36 9.37,8.13 C17.2
N$11  (via drill 0.3)
  Top 0.2: U3.3 9.89,9.2 v12.04,9.2 | v31.94,16.9 31.94,18.71 C18.2
  Bottom 0.2: v12.04,9.2 21.1,9.2 28.44,16.55 31.94,16.55 v31.94,16.9
N$12
  Top 0.203: C17.1 9.58,6.91 12.62,6.91 R2.1 12.83,7.11 12.83,9.96 R7.2
N$13
  Top 0.2: R5.1 43.12,33.25 44.19,33.25 44.89,33.95 C16.1
  Top 0.203: R4.2 44.93,39.01 44.93,38.61 45.75,37.8 45.75,36.58 44.93,35.76 C16.1
N$14
  Top 0.203: C15.1 43.71,37.39 43.71,39.01 R4.1 43.71,39.22 45.14,40.64 45.14,40.84 47.17,42.88 47.57,42.88 50.62,45.92 51.23,45.92 U2.3
N$15  (via drill 0.3)
  Top 0.254: U6.9 56.84,41.34 56.74,41.25 56.74,38.87 U6.8 55.14,38.87 v55.14,38.05 | U7.P6 42.19,19.38 v42.19,19.4 | v45,23.85 45,27.55 44.59,27.95 v44.59,28.2
  Bottom 0.254: v42.19,19.4 42.19,21.05 v45,23.85 | v44.59,28.2 46.64,28.2 55.14,36.7 v55.14,38.05
N$16
  Top 0.254: U3.14 | U3.14 6.07,12.25 C21.1
N$17
  Top 0.203: U3.16 8.15,11.18 6.73,11.18 6.12,10.57 C22.1
N$18
  Top 0.203: U3.1 8.76,10.36 7.75,10.36 6.12,8.74 C23.1
N$19
  Top 0.2: U8.3 28.13,37.01 28.43,36.71 28.43,33.64 27.85,33.05 27.85,31.92 C24.1
N$20  (via drill 0.3)
  Top 0.2: v44.55,46.05 44.55,44.86 C25.1
  Top 0.254: U8.5 26.29,38.28 v26.29,38.3 | v32,43.85 v37.34,43.85
  Bottom 0.2: v37.34,43.85 40.09,43.85 40.89,44.65 43.14,44.65 v44.55,46.05
  Bottom 0.254: v26.29,38.3 31,38.3 32,39.3 v32,43.85
N$21
  Top 0.254: U7.A2 U7.A3
N$22
  Top 0.254: U7.P8 40.05,18.38 40.05,17.85 D1.2
N$23  (via drill 0.3)
  Top 0.2: U8.25 v23.84,37.65 v23.85,37.65 | v28.6,37.65 28.6,37.3 28.85,37.05 28.85,32.99 C28.1
  Bottom 0.2: v23.84,37.65 v28.59,37.65 v28.6,37.65
N$25
  Top 0.254: D2.1 40.05,20.1 40.05,18.9 41.3,18.9 U7.P7
N$26  (via drill 0.3)
  Top 0.2: U3.10 9.89,14.6 | 9.89,14.6 | 9.89,14.6 v11.14,14.6 | v15.95,19.3 15.95,21.9 v15.59,22.25 | U8.1 27.52,33.38 27,32.85 v27,32.4
  Bottom 0.2: v11.14,14.6 11.25,14.6 v15.95,19.3 | v15.59,22.25 15.59,23.1 19.5,27 19.5,30.7 19.04,31.15 19.04,31.85 21.1,33.9 21.85,33.9 23.04,32.7 26.44,32.7 26.75,32.4 v27,32.4
N$28
  Top 0.254: D3.2 39.44,22.25 39.44,20.9 41.3,20.9 U7.P3
N$29
  Top 0.254: D4.1 40,24.47 40,21.4 41.3,21.4 U7.P2
N$30
  Top 0.203: 35.99,17.88 34.16,17.88 R8.1 | D4.2 35.99,24.38 35.99,22.35 D3.1 35.99,22.15 35.99,20.12 D2.2 35.99,19.91 35.99,17.88 | 35.99,17.88 D1.1
N$33  (via drill 0.3)
  Top 0.203: v11.61,39.41 11.61,36.58 IC2.4
  Bottom 0.203: v11.61,39.41 11.61,44.5 17.09,49.99 U$27.11
N$34  (via drill 0.3)
  Top 0.203: v14.25,38.2 14.25,36.58 IC2.6
  Bottom 0.203: v14.25,38.2 24.61,48.56 24.61,49.99 U$27.17
N$36  (via drill 0.3)
  Top 0.203: v18.11,33.33 15.47,35.97 15.47,36.37 IC2.7
  Bottom 0.2: v18.11,33.33 18.11,33.47 19.04,34.4 22.1,34.4 23.29,33.2 27.33,33.2 27.46,33.33
  Bottom 0.203: 27.46,33.33 33.55,39.42 33.55,50.6 32.74,51.41 31.11,51.41 29.9,50.19 U$27.21
N$37  (via drill 0.3)
  Top 0.203: v16.69,39.62 16.69,36.58 IC2.8
  Bottom 0.203: v16.69,39.62 16.69,40.03 25.63,48.97 31.32,48.97 32.33,49.99 U$27.23
N$38  (via drill 0.3)
  Top 0.203: v18.11,34.95 18.11,36.37 IC2.9 | v32.74,47.95 34.77,49.99 U$27.25
  Bottom 0.203: v18.11,34.95 22.17,34.95 23.38,33.73 27.25,33.73 32.74,39.22 v32.74,47.95
N$39
  Top 0.203: IC3.2 40.26,45.92 40.26,48.77 41.07,49.58 41.07,50.6 40.26,51.41 38.84,51.41 37.62,50.19 U$27.27
N$40
  Top 0.203: IC3.3 39.04,45.92 39.04,49.17 39.85,49.99 U$27.29
N$45
  Top 0.203: IC3.4 37.62,45.72 37.62,45.11 38.23,44.5 41.89,44.5 42.09,44.7 42.09,46.13 44.93,48.97 54.08,48.97 55.09,49.99 U$27.41
N$46  (via drill 0.3)
  Top 0.203: v38.02,48.16 36.4,46.53 36.4,45.92 IC3.5 | v46.15,48.16 55.91,48.16 57.73,49.99 U$27.43
  Bottom 0.203: v46.15,48.16 v38.02,48.16
N$51
  Top 0.203: U5.2 33.96,8.74 33.96,9.75 38.02,13.82 38.02,14.63 R9.P$1
N$55  (via drill 0.3)
  Top 0.203: v12.62,20.93 11.41,19.71 10.39,19.71 IC1.7 | v23.8,48.77 25.02,48.77 26.24,49.99 26.24,50.6 27.25,51.61 28.68,51.61 29.69,52.63 U$27.22
  Bottom 0.203: v12.62,20.93 14.25,22.55 14.25,37.19 13.44,38 13.44,38.41 v23.8,48.77
N$102  (via drill 0.3)
  Top 0.203: v8.97,43.69 8.97,36.58 IC2.2
  Bottom 0.203: v8.97,43.69 8.97,48.16 7.14,49.99 U$27.3
N$103  (via drill 0.3)
  Top 0.203: v9.78,40.23 10.18,39.83 10.18,36.58 IC2.3
  Bottom 0.203: v9.78,40.23 9.78,49.78 9.58,49.99 U$27.5
OF  (via drill 0.3)
  Top 0.203: v8.76,24.59 9.78,23.57 10.18,23.57 IC1.4 | v6.32,40.7 6.32,47.14 8.15,48.97 17.5,48.97 18.52,49.99 18.52,50.6 19.53,51.61 21.16,51.61 22.17,52.63 U$27.16
  Bottom 0.203: v8.76,24.59 8.76,38.26 v6.32,40.7
OF_B  (via drill 0.3)
  Top 0.2: U8.27 21.17,36.38 v21.1,36.3 | IC1.16 17.96,22.23 17.6,22.6 17.6,25.85 v17.34,26.1
  Bottom 0.2: v21.1,36.3 17.75,36.3 17.34,35.9 v17.34,26.1
PWMA  (via drill 0.3)
  Top 0.203: v30.1,15.65 30.1,21.54 U4.23
  Bottom 0.203: v30.1,15.65 28.27,15.65 19.74,7.11 19.74,4.47 U$27.60
SIG  (via drill 0.3)
  Top 0.203: v13.44,28.25 11.41,26.21 10.39,26.21 IC1.2
  Bottom 0.203: v13.44,28.25 13.44,22.35 12.83,21.74 12.42,21.74 11.61,22.55 11.61,38.04 10.79,38.85 10.79,44.7 16.08,49.99 16.08,51.61 17.09,52.63 U$27.12
SIG_B  (via drill 0.3)
  Top 0.203: v29.9,24.59 20.55,24.59 IC1.18
  Bottom 0.203: v29.9,24.59 47.37,24.59 49.4,22.55 49.4,12.8 47.78,11.18 47.78,9.96 U5.4
SNS  (via drill 0.3)
  Top 0.203: v7.95,26.62 9.78,24.79 10.18,24.79 IC1.3 | v5.51,41.86 5.51,47.14 8.36,49.99 8.36,50.6 9.37,51.61 18.52,51.61 19.53,52.63 U$27.14
  Bottom 0.203: v7.95,26.62 7.95,37.91 5.51,40.34 v5.51,41.86
SNS_B  (via drill 0.3)
  Top 0.2: v23.64,34.75 22.85,33.95 22.85,32.9 19.79,29.85 v18.29,29.85 | v18.29,26.85 18.29,23.85 18.6,23.55 20.38,23.55 IC1.17 | U8.4 26.99,37.65 v26.19,36.85
  Bottom 0.2: v26.19,36.85 25.75,36.85 v23.64,34.75 | v18.29,29.85 v18.29,26.85
STBY  (via drill 0.3)
  Top 0.203: v12.62,22.55 11.2,21.13 10.39,21.13 IC1.6
  Bottom 0.203: v12.62,22.55 12.62,38.41 22.99,48.77 22.99,49.38 23.6,49.99 23.6,50.6 24.61,51.61 26.24,51.61 27.25,52.63 U$27.20
STBY_B
  Top 0.203: U4.19 27.25,21.54 27.25,20.73 26.64,20.12 22.99,20.12 22.58,19.71 20.55,19.71 IC1.14
VCC  (via drill 0.3)
  Top 0.2: U8.23 24.38,38.92 24.69,38.6 C27.1 | 10.39,13.61 12.63,13.61 C19.2 | 14.86,24.18 14.86,24.71 18.39,28.25 18.93,28.25 24.21,33.53 | 46.76,27.84 46.76,25.67 46.39,25.3 46.39,23.3 46.3,23.2 | C29.1 43.95,23.2 43.95,23.19 44.14,23 46.39,23 46.44,22.95
  Top 0.203: 5.92,11.79 8.15,11.79 U3.15 | 5.92,11.79 4.9,12.8 C21.2 | 10.39,13.61 U3.9 | 5.92,11.79 4.7,10.57 C22.2 4.7,10.36 4.7,8.74 C23.2 4.7,8.53 8.36,4.88 8.36,4.06 9.37,3.05 11,3.05 12.01,2.03 U$27.53 | 8.56,14.22 7.14,15.65 7.14,44.19 7.75,44.79 7.75,46.53 IC2.20 | 48.39,35.36 48.39,37.39 C3.1 | 48.39,35.36 48.59,35.15 C4.1 | C4.1 48.79,34.95 48.79,34.54 49.4,33.93 49.4,32.92 U1.14 | 48.39,35.36 47.37,34.34 | 47.37,34.34 46.97,33.93 46.97,32.92 U1.18 | 48.39,35.36 C4.1 | C6.1 46.56,23.57 46.56,25.2 C5.1 46.56,25.4 46.76,25.6 46.76,27.84 U1.3 | U2.7 46.36,44.7 45.54,44.7 43.51,42.67 C26.1 43.31,42.47 42.49,42.47 v42.09,42.06 | C31.1 34.77,26.21 37.21,26.21 38.84,27.84 38.84,28.45 40.06,29.67 C12.+ 40.06,29.87 40.06,33.12 41.28,34.34 41.28,35.76 IC3.20 41.48,35.97 41.48,36.37 42.09,36.98 v42.09,37.39 | v43.51,27.23 43.51,25.81 C11.1 | v47.17,34.54 47.37,34.34 | v27.66,19.1 27.86,19.3 27.86,21.54 U4.20 | v11.2,10.36 12.62,11.79 C20.2 | v12.01,14.22 12.62,13.61 C19.2 | 24.21,33.53 24.61,33.53 C27.1 | v14.86,17.07 14.86,24.18 | v21.97,25.4 21.97,26.42 21.16,27.23 20.55,27.23 IC1.20
  Top 0.254: U8.23 U8.22 U8.7 | U7.F4 46.3,19.38 46.44,19.38 | 46.44,19.38 U7.A6 | C6.1 46.44,23.46 46.44,22.95 46.44,19.38 | 8.56,14.22 4.77,14.22 C21.2 | C11.1 43.62,23.53 C29.1
  Bottom 0.2: v27.66,19.1 34.16,19.1 34.16,12.6
  Bottom 0.203: v42.09,42.06 v42.09,37.39 41.68,36.98 41.68,35.15 43.51,33.33 | 43.51,33.33 v43.51,27.23 45.34,27.23 50.22,22.35 50.22,9.75 49.2,8.74 U5.3 49,8.74 45.54,8.74 42.49,11.79 34.16,11.79 | v47.17,34.54 44.73,34.54 43.51,33.33 | 34.16,11.79 34.16,11.18 U5.1 | 34.16,11.79 34.16,12.6 | U$27.53 12.01,2.03 11,3.05 11,4.88 11.2,5.08 v11.2,10.36 12.01,11.18 v12.01,14.22 v14.86,17.07 17.91,20.12 | v21.97,25.4 21.97,24.18 17.91,20.12 | v27.66,19.1 26.64,19.1 23.6,16.05 21.97,16.05 17.91,20.12
VCM
  Top 0.203: C7.1 53.87,40.84 51.44,38.41 51.44,32.92 U1.11
VM  (via drill 0.3)
  Top 0.203: C32.A 24,15.04 23.6,15.44 23.6,19.1 C30.1 23.39,19.1 22.58,19.1 v22.38,18.9 | U4.24 30.5,21.74 30.5,22.35 29.08,23.77 25.63,23.77 24.21,22.35 24.21,21.74 U4.14 24,21.54 23.6,21.54 U4.13 23.39,21.54 v22.38,20.52
  Bottom 0.203: v22.38,20.52 v22.38,18.9

### Text on the board
tPlace: MOTOR